# Altium schematic sheet Fonte3V3.SchDoc
size A4; Engineer: Kayann Soares; SheetNumber: 7; SheetTotal: 11; CompanyInfo1: Universidade Federal do Ceará; CompanyInfo2: Centro de Tecnologia - CT; CompanyInfo3: Dep. de Eng. de Teleinformática
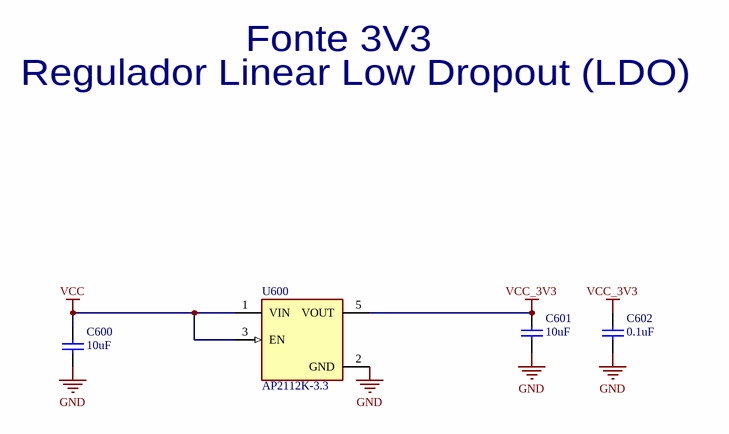
[diagram p0: Fonte3V3.SchDoc]

## Parts
C600  10uF  [CAP_CER_0805]
C601  10uF  [CAP_CER_0805]
C602  0.1uF  [CAP_CER_0603]
U600  AP2112K-3.3  [AP2112K-3.3]

## Nets
GND: C600.2 C601.2 C602.1 U600.2(GND)
VCC: C600.1 U600.1(VIN) U600.3(EN)
VCC_3V3: C601.1 C602.2 U600.5(VOUT)

## Notes on the sheet
- Fonte 3V3
- Regulador Linear Low Dropout (LDO)
- Título:
- Padrão:
- Projeto:
- Eng. Responsável:
- A4
- Data:
- Versão:
- Folha:
- V1
- de
- Arquivo:

## Library data of the parts
C600 C601 = CAP_CER_10uF_0805: Supplier 1: Arrow Electronics; Supplier Part Number 1: CL21A106KOQNNNE
C602 = CAP_CER_0.1uF_0603: Supplier 1: Digi-Key Marketplace; Supplier Part Number 1: 2571-GMC10X7R104J25NTTR-ND
U600 = AP2112K-3.3: Supplier 1: Future Electronics; Supplier Part Number 1: 8043011